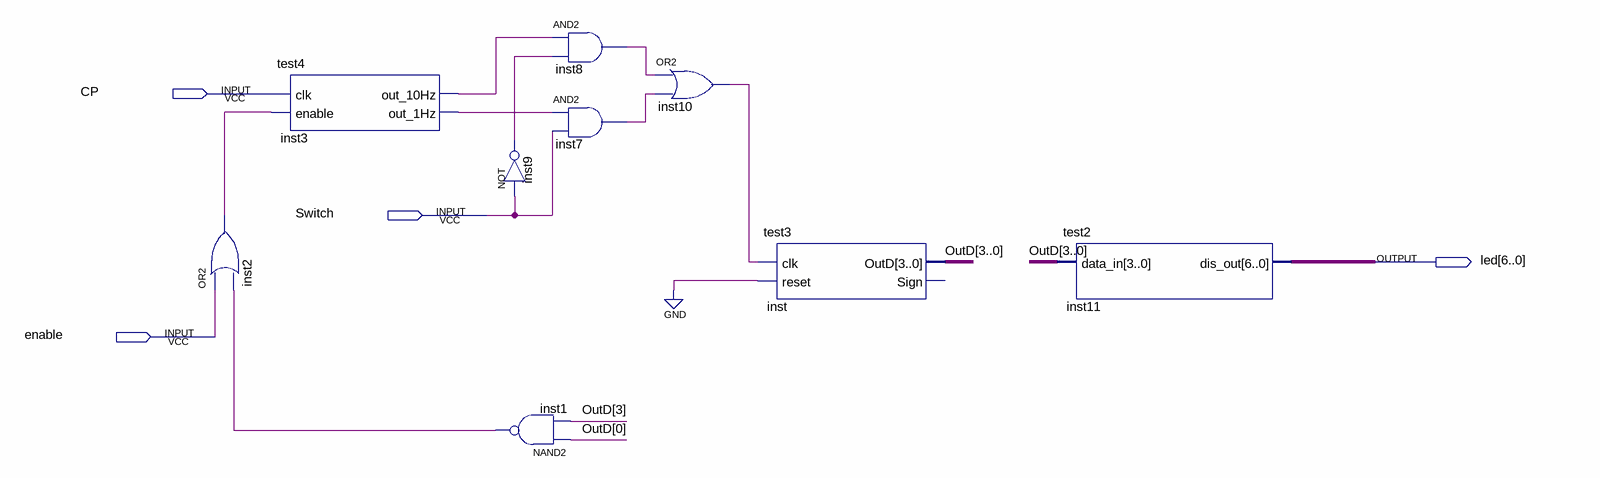
[diagram p0: schematic sheet]
// Quartus schematic test5.bdf as structural Verilog: 9 symbols, 4 pins
module test5 (
  input  CP,
  input  Switch,
  input  enable,
  output [6:0] led
);

  wire inst1_out, inst2_out, inst3_out_1hz, inst3_out_10hz, inst7_out, inst8_out, inst9_out, inst10_out;
  wire [3:0] OutD;

  or inst2 (inst2_out, enable, inst1_out);
  test4 inst3 (.clk(CP), .enable(inst2_out), .out_10Hz(inst3_out_10hz), .out_1Hz(inst3_out_1hz));
  not inst9 (inst9_out, Switch);
  nand inst1 (inst1_out, OutD[0], OutD[3]);
  and inst8 (inst8_out, inst3_out_10hz, inst9_out);
  and inst7 (inst7_out, inst3_out_1hz, Switch);
  or inst10 (inst10_out, inst8_out, inst7_out);
  test3 inst (.clk(inst10_out), .reset(1'b0), .OutD(OutD));  // open: Sign
  test2 inst11 (.data_in(OutD), .dis_out(led));
endmodule
